# EAGLE design clock (EAGLE 9.3.0)
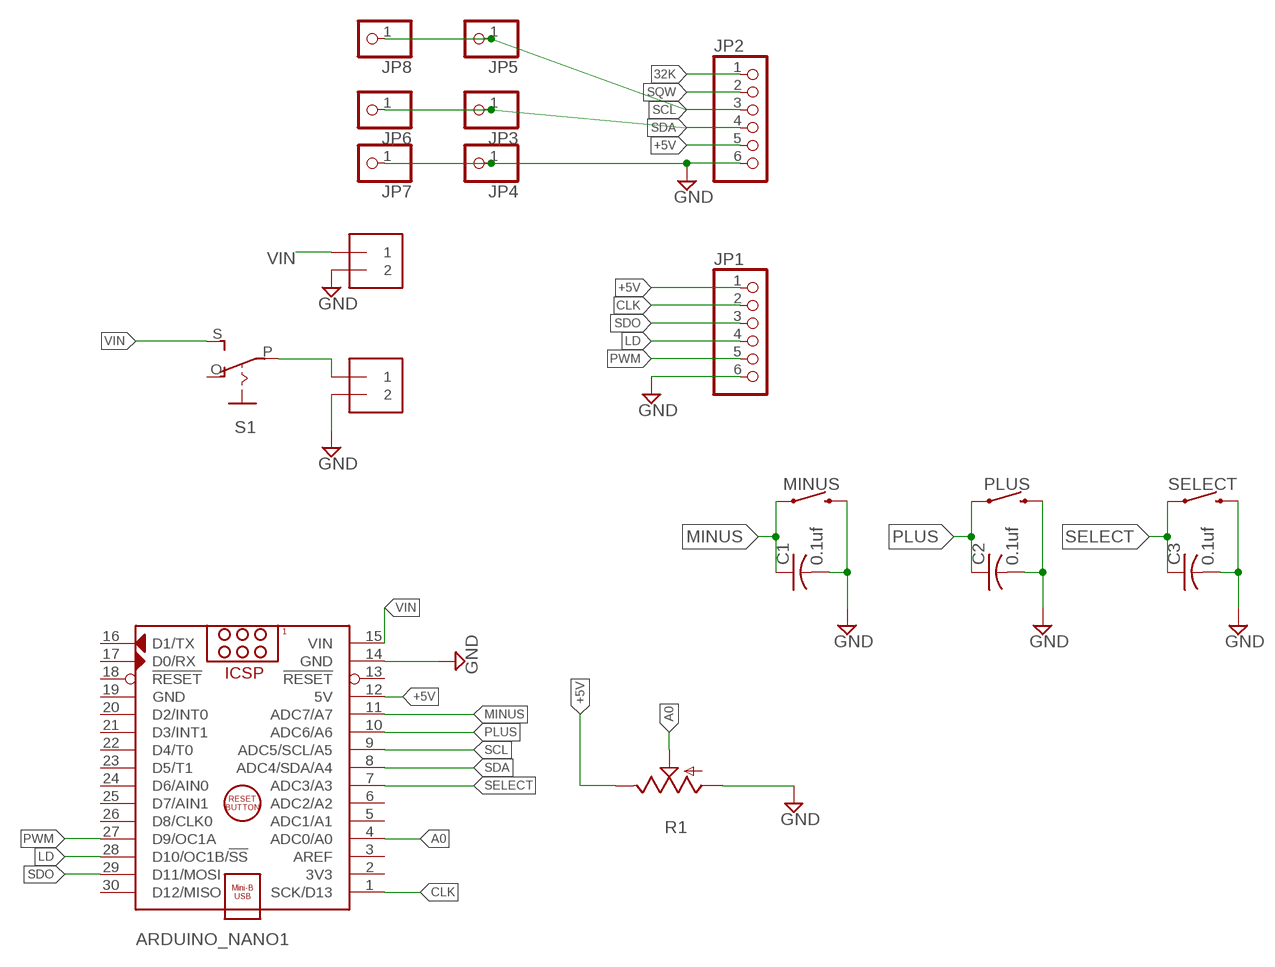
[diagram p0: schematic, sheet 1]

## Parts
ARDUINO_NANO1  ARDUINO_NANO  [ARDUINO_NANO]
C1  0.1uf  C-US025-025X050  [C025-025X050]
C2  0.1uf  C-US025-025X050  [C025-025X050]
C3  0.1uf  C-US025-025X050  [C025-025X050]
J1  1X2-3.5MM  [1X2-3.5MM]
J2  1X2-3.5MM  [1X2-3.5MM]
JP1  PINHD-1X6  [1X06]
JP2  PINHD-1X6  [1X06]
JP3  PINHD-1X1  [1X01]
JP4  PINHD-1X1  [1X01]
JP5  PINHD-1X1  [1X01]
JP6  PINHD-1X1  [1X01]
JP7  PINHD-1X1  [1X01]
JP8  PINHD-1X1  [1X01]
MINUS  MOMENTARY-SWITCH-SPST-PTH-6.0MM  [TACTILE_SWITCH_PTH_6.0MM]
PLUS  MOMENTARY-SWITCH-SPST-PTH-6.0MM  [TACTILE_SWITCH_PTH_6.0MM]
R1  TRIM_US-RS3  [RS3]
S1  EG1218S  [EG1218]
SELECT  MOMENTARY-SWITCH-SPST-PTH-6.0MM  [TACTILE_SWITCH_PTH_6.0MM]

## Nets
32K: JP2.1
+5V: ARDUINO_NANO1.12(5V) JP1.1 JP2.5 R1.E
A0: ARDUINO_NANO1.4(ADC0/A0) R1.S
CLK: ARDUINO_NANO1.1(SCK/D13) JP1.2
GND: ARDUINO_NANO1.14(GND) C1.2 C2.2 C3.2 J1.2 J2.2 JP1.6 JP2.6 JP4.1 JP7.1 MINUS.3 PLUS.3 R1.A SELECT.3
LD: ARDUINO_NANO1.28(D10/OC1B/!SS) JP1.4
MINUS: ARDUINO_NANO1.11(ADC7/A7) C1.1 MINUS.1
N$1: J1.1 S1.P
PLUS: ARDUINO_NANO1.10(ADC6/A6) C2.1 PLUS.1
PWM: ARDUINO_NANO1.27(D9/OC1A) JP1.5
SCL: ARDUINO_NANO1.9(ADC5/SCL/A5) JP2.3 JP5.1 JP8.1
SDA: ARDUINO_NANO1.8(ADC4/SDA/A4) JP2.4 JP3.1 JP6.1
SDO: ARDUINO_NANO1.29(D11/MOSI) JP1.3
SELECT: ARDUINO_NANO1.7(ADC3/A3) C3.1 SELECT.1
SQW: JP2.2
VIN: ARDUINO_NANO1.15(VIN) J2.1 S1.S
Unconnected: ARDUINO_NANO1.2(3V3) ARDUINO_NANO1.3(AREF) ARDUINO_NANO1.5(ADC1/A1) ARDUINO_NANO1.6(ADC2/A2) ARDUINO_NANO1.13(!RESET) ARDUINO_NANO1.16(D1/TX) ARDUINO_NANO1.17(D0/RX) ARDUINO_NANO1.18(!RESET) ARDUINO_NANO1.20(D2/INT0) ARDUINO_NANO1.21(D3/INT1) ARDUINO_NANO1.22(D4/T0) ARDUINO_NANO1.23(D5/T1) ARDUINO_NANO1.24(D6/AIN0) ARDUINO_NANO1.25(D7/AIN1) ARDUINO_NANO1.26(D8/CLK0) ARDUINO_NANO1.30(D12/MISO) S1.O

## Power pins joined to a net without a drawn wire
GND: ARDUINO_NANO1.19(GND)

## Library data of the parts
ARDUINO_NANO1 = ArduinoNanoV30:ARDUINO_NANO: Arduino Nano V3.0 Module Overview: The Arduino Nano is a small, complete, and breadboard-friendly board based on the ATmega328 (Arduino Nano 3.x) or ATmega168 (Arduino Nano 2.x). It has more or less the same functionality of the Arduino Duemilanove, but in a different package. It lacks only a DC power jack, and works with a Mini-B USB cable instead of a standard one. The Nano was designed and is being produced by Gravitech <http://www.gravitech.us/arna30wiatp.html>. General specifications: Item Value Microcontroller Atmel ATmega168 or ATmega328 Operating Voltage (logic level) 5 V Input Voltage (recommended) 7-12 V Input Voltage (limits) 6-20 V Digital I/O Pins 14 (of which 6 provide PWM output) Analog Input Pins 8 DC Current per I/O Pin 40 mA Flash Memory 16 KB (ATmega168) or 32 KB (ATmega328) of which 2 KB used by bootloader SRAM 1 KB (ATmega168) or 2 KB (ATmega328) EEPROM 512 bytes (ATmega168) or 1 KB (ATmega328) Clock Speed 16 MHz Dimensions (Inches) 0.73" x 1.70" Dimensions (mm) 18mm x 45mm Overall height About 9 mm (not including pins) Weigth 5 g Power: The Arduino Nano can be powered via the Mini-B USB connection, 6-20V unregulated external power supply (pin 30), or 5V regulated external power supply (pin 27). The power source is automatically selected to the highest voltage source. Memory: The ATmega168 has 16 KB of flash memory for storing code (of which 2 KB is used for the bootloader); the ATmega328 has 32 KB, (also with 2 KB used for the bootloader). The ATmega168 has 1 KB of SRAM and 512 bytes of EEPROM (which can be read and written with the EEPROM library); the ATmega328 has 2 KB of SRAM and 1 KB of EEPROM. Input and Output: Each of the 14 digital pins on the Nano can be used as an input or output, using pinMode(), digitalWrite(), and digitalRead() functions. They operate at 5 volts. Each pin can provide or receive a maximum of 40 mA and has an internal pull-up resistor (disconnected by default) of 20-50 kOhms. In addition, some pins have specialized functions. Visit Arduino - ArduinoBoardNano <https://www.arduino.cc/en/Main/ArduinoBoardNano>
C1-C3 = adafruit:C-US: CAPACITOR, American symbol
J1 J2 = adafruit:1X2: 3.5mm Terminal block http://www.ladyada.net/library/pcb/eaglelibrary.html
JP1 JP2 = adafruit:PINHD-1X6: PIN HEADER
JP3-JP8 = adafruit:PINHD-1X1: Pin header 1x1 for 0.1" spacing With round pins
MINUS PLUS SELECT = SparkFun-Switches:MOMENTARY-SWITCH-SPST: Momentary Switch (Pushbutton) - SPST Normally-open (NO) SPST momentary switches (buttons, pushbuttons). Variants PTH-12MM - 12mm square, through-hole Momentary Pushbutton Switch - 12mm Square <https://www.sparkfun.com/products/9190> (COM-09190) PTH-6.0MM, PTH-6.0MM-KIT - 6.0mm square, through-hole Mini Pushbutton Switch <https://www.sparkfun.com/products/97> (COM-00097) KIT package intended for soldering kit's - only one side of pads' copper is exposed. PTH-RIGHT-ANGLE-KIT - Right-angle, through-hole Right Angle Tactile Button <https://www.sparkfun.com/products/10791> - Used on SparkFun BigTime Watch Kit <https://www.sparkfun.com/products/11734> SMD-12MM - 12mm square, surface-mount Tactile Button - SMD (12mm) <https://www.sparkfun.com/products/12993> (COM-12993) Used on SparkFun PicoBoard <https://www.sparkfun.com/products/11888> SMD-4.5MM - 4.5mm Square Trackball Switch Used on SparkFun Blackberry Trackballer Breakout <https://www.sparkfun.com/products/13169> SMD-4.6MMX2.8MM - 4.60mm x 2.80mm, surface mount Used on SparkFun SAMD21 Mini Breakout <https://www.sparkfun.com/products/13664> SMD-5.2MM, SMD-5.2-REDUNDANT - 5.2mm square, surface-mount Mini Pushbutton Switch - SMD <https://www.sparkfun.com/products/8720> (COM-08720) Used on Arduino Pro Mini <https://www.sparkfun.com/products/11114> REDUNDANT package connects both switch circuits together SMD-6.0X3.5MM - 6.0 x 3.5mm, surface mount Momentary Reset Switch SMD <https://www.sparkfun.com/products/8229> (COM-08229) SMD-6.2MM-TALL - 6.2mm square, surface mount Tactile Button - SMD (6mm) <https://www.sparkfun.com/products/12992> Used on SparkFun Digital Sandbox <https://www.sparkfun.com/products/12651> SMD-RIGHT-ANGLE - Right-angle, surface mount Used on SparkFun Block for Intel® Edison - Arduino <https://www.sparkfun.com/products/13036>; PROD_ID: SWCH-08441; SF_SKU: COM-00097
R1 = pot:TRIM_US-: POTENTIOMETER
S1 = adafruit:EG1218: SLIDING SWITCH 0.1" spacing through hole, vertical SPDT slide switch http://www.ladyada.net/library/pcb/eaglelibrary.html

## Board
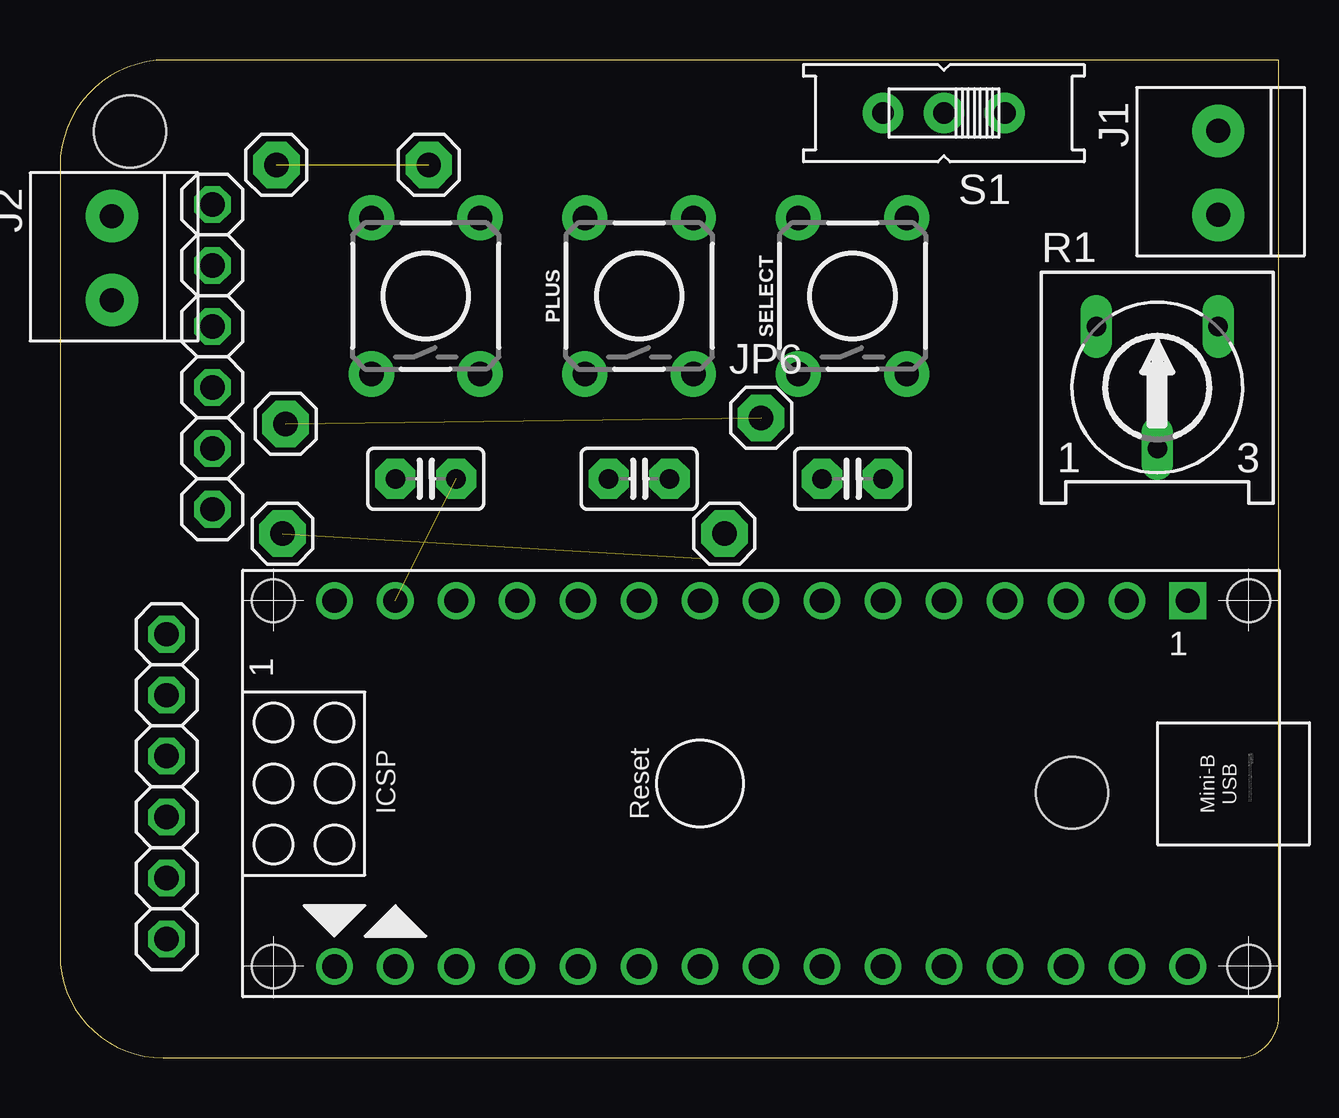
[diagram p1: board, top side]
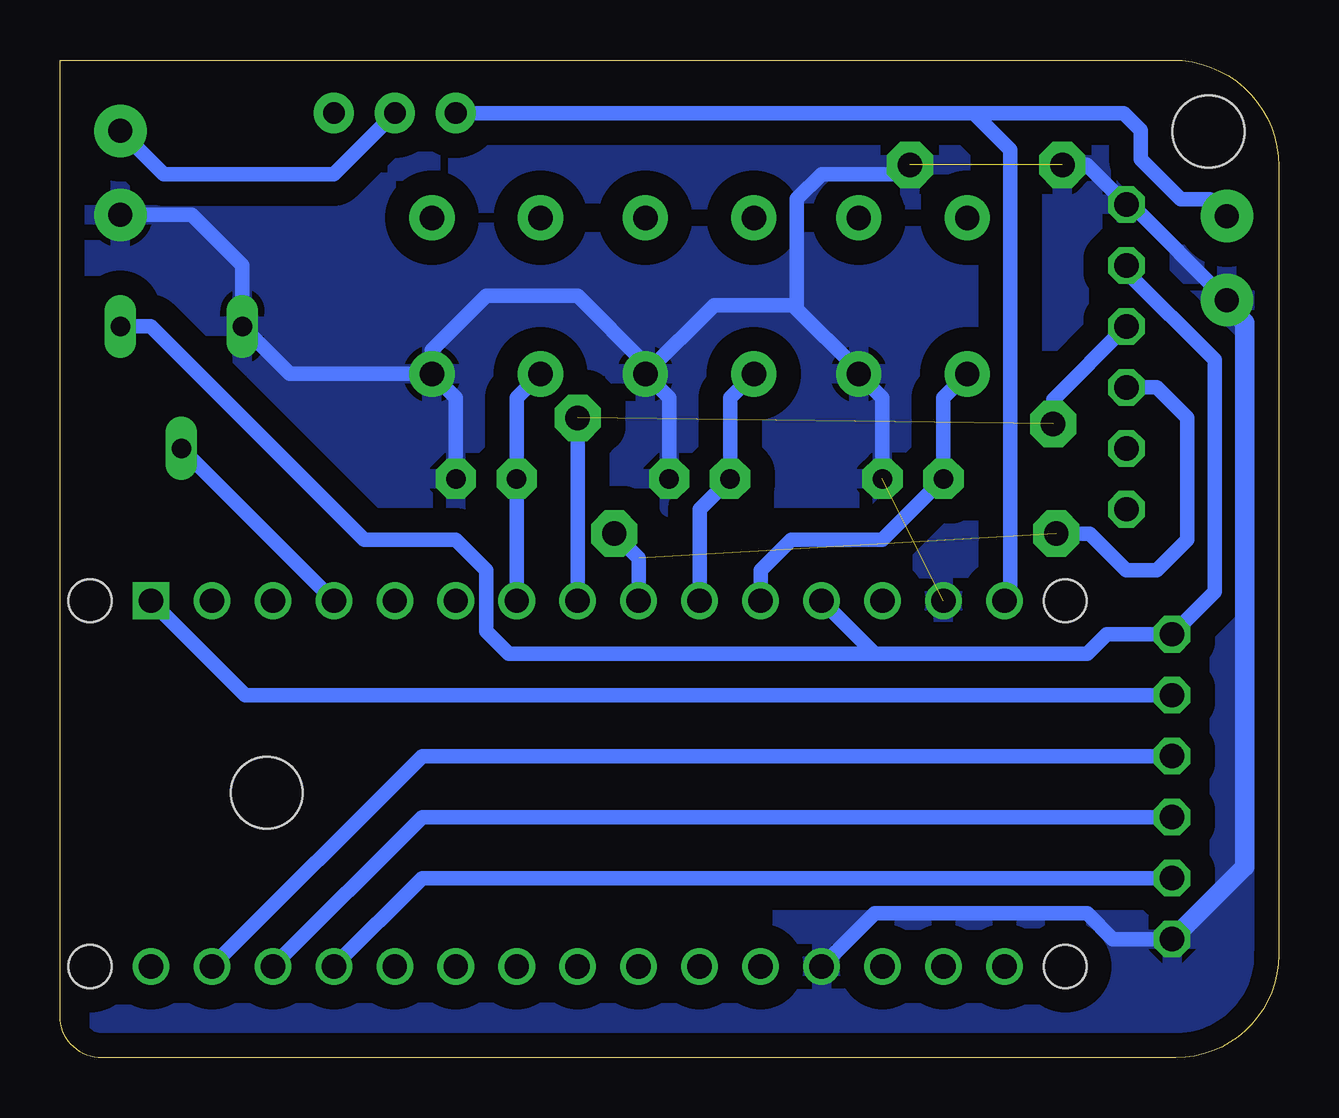
[diagram p2: board, bottom side, seen from below]

Size 50.78 x 41.58 mm. Coordinates in mm from the lower left corner, seen from the top.
Outline: 50.78,41.58 4.42,41.58 arc90 0,37.16 0,4.3 arc90 4.3,0 49.03,0 arc90 50.78,1.75 50.78,41.58
Copper layers (1*16): Top 0.035mm / dielectric 1.5mm / Bottom 0.035mm
Design rules "default": minimum track width 6mil, minimum drill 0.35mm, track to track 6mil, track to pad 6mil, pad to pad 6mil, via to via 6mil, smd to smd 6mil, copper to edge 40mil, drill to drill 6mil, minimum pad ring 10mil, minimum via ring 8mil, stop-mask expansion 4mil, vias tented up to drill 0mil, thermal gap 10mil
Holes 3 mm at 2.92,38.61 42.16,11.05

### Footprints (pad centres in the part's own frame; a part is rotated, then mirrored left to right if it is on the bottom)
ARDUINO_NANO = drill 1.016 square: 1 -20.32,-7.62 | drill 1.016: 2 -17.78,-7.62; 3 -15.24,-7.62; 4 -12.7,-7.62; 5 -10.16,-7.62; 6 -7.62,-7.62; 7 -5.08,-7.62; 8 -2.54,-7.62; 9 0,-7.62; 10 2.54,-7.62; 11 5.08,-7.62; 12 7.62,-7.62; 13 10.16,-7.62; 14 12.7,-7.62; 15 15.24,-7.62; 16 15.24,7.62; 17 12.7,7.62; 18 10.16,7.62; 19 7.62,7.62; 20 5.08,7.62; 21 2.54,7.62; 22 0,7.62; 23 -2.54,7.62; 24 -5.08,7.62; 25 -7.62,7.62; 26 -10.16,7.62; 27 -12.7,7.62; 28 -15.24,7.62; 29 -17.78,7.62; 30 -20.32,7.62 | hole 1.778: -22.86,-7.62; -22.86,7.62; 17.78,7.62; 17.78,-7.62
C025-025X050 = drill 0.813 pad 1.676 octagon: 1 -1.27,0; 2 1.27,0
1X2-3.5MM = drill 1 pad 2.184: 1 1.8,0; 2 -1.7,0
1X06 = drill 1.016 octagon: 1 -6.35,0; 2 -3.81,0; 3 -1.27,0; 4 1.27,0; 5 3.81,0; 6 6.35,0
1X01 = drill 1.016 pad 1.93 octagon: 1 0,0
TACTILE_SWITCH_PTH_6.0MM = drill 1.016 pad 1.88: 1 -3.251,2.261; 2 3.251,2.261; 3 -3.251,-2.261; 4 3.251,-2.261
RS3 = drill 0.813 long: A -2.54,2.54; E 2.54,2.54; S 0,-2.54
EG1218 = drill 0.9 pad 1.676: O -2.54,0; P 0,0; S 2.54,0

### Placement (x,y rotation side)
ARDUINO_NANO1  26.67,11.43 180 top
C1  15.24,24.13 0 top
C2  24.13,24.13 0 top
C3  33.02,24.13 0 top
J1  48.26,36.83 90 top
J2  2.16,33.27 90 top
JP1  4.45,11.3 270 top
JP2  6.35,29.21 90 top
JP3  9.4,26.42 0 top
JP4  9.02,37.21 0 top
JP5  9.27,21.84 0 top
JP6  29.21,26.67 0 top
JP7  15.37,37.21 0 top
JP8  27.69,21.84 0 top
MINUS  15.24,31.75 90 top
PLUS  24.13,31.75 90 top
R1  45.72,27.94 0 top
S1  36.83,39.37 180 top
SELECT  33.02,31.75 90 top

### Tracks (layer width: path | path; a pad name or v marks a point on that pad's centre or on a via)
+5V
  Bottom 0.61: 16.84,16.84 7.98,16.84 7.16,17.65 JP1.1 2.67,19.43 2.67,29.08 6.35,32.77 JP2.5 | 16.84,16.84 ARDUINO_NANO1.12 | 16.84,16.84 32.08,16.84 33.02,17.78 33.02,20.32 34.29,21.59 38.1,21.59 46.99,30.48 R1.E
A0
  Bottom 0.61: ARDUINO_NANO1.4 R1.S
CLK
  Bottom 0.61: JP1.2 43.05,15.11 ARDUINO_NANO1.1
GND  (2 unrouted)
  Bottom 0.61: C1.2 16.51,27.51 MINUS.3 17.5,28.63 20.22,31.34 20.22,31.37 | PLUS.3 25.4,27.51 C2.2 | SELECT.3 34.29,27.51 C3.2 | PLUS.3 23.52,31.37 20.22,31.37 | 20.22,31.37 20.12,31.37 20.09,31.34 20.09,35.79 19.05,36.83 15.75,36.83 JP7.1 | PLUS.3 26.39,28.93 29.21,31.75 33.02,31.75 35.28,29.49 SELECT.3 | SELECT.3 41.2,28.5 R1.A 43.18,33.02 45.29,35.13 J1.2 | JP1.6 6.91,4.95 7.98,6.02 16.84,6.02 ARDUINO_NANO1.19 | JP4.1 8,37.21 JP2.6 6.15,35.56 J2.2
  Bottom 0.813: J2.2 2.16,31.37 1.42,30.63 1.42,7.98 JP1.6
  pour Bottom (isolate 1.016): -5.08,43.18 -5.08,3.81 2.54,-3.81 55.88,-3.81 58.42,-1.27 58.42,41.91 54.61,45.72 -2.54,45.72
LD
  Bottom 0.61: JP1.4 35.69,10.03 ARDUINO_NANO1.28
MINUS
  Bottom 0.61: MINUS.1 13.97,27.51 C1.1 16.51,21.59 20.32,21.59 21.59,20.32 ARDUINO_NANO1.11
N$1
  Bottom 0.61: S1.P 39.37,36.83 46.46,36.83 J1.1
PLUS
  Bottom 0.61: PLUS.1 22.86,27.51 C2.1 24.13,22.86 ARDUINO_NANO1.10
PWM
  Bottom 0.61: JP1.5 35.69,7.49 ARDUINO_NANO1.27
SCL  (1 unrouted)
  Bottom 0.61: ARDUINO_NANO1.9 26.67,20.83 JP8.1 | JP2.3 5.08,27.94 3.81,26.67 3.81,21.59 5.08,20.32 6.35,20.32 7.87,21.84 JP5.1
SDA  (1 unrouted)
  Bottom 0.61: ARDUINO_NANO1.8 JP6.1 | JP2.4 9.4,27.43 JP3.1
SDO
  Bottom 0.61: JP1.3 35.69,12.57 ARDUINO_NANO1.29
SELECT
  Bottom 0.61: SELECT.1 31.75,27.51 C3.1 ARDUINO_NANO1.7
VIN
  Bottom 0.61: 12.7,39.37 11.18,37.85 11.18,19.3 ARDUINO_NANO1.15 | 12.7,39.37 S1.S | 12.7,39.37 6.45,39.37 5.74,38.66 5.74,37.44 4.09,35.79 2.87,35.79 J2.1